# Altium schematic sheet Voltage_Regulation.SchDoc
size A4
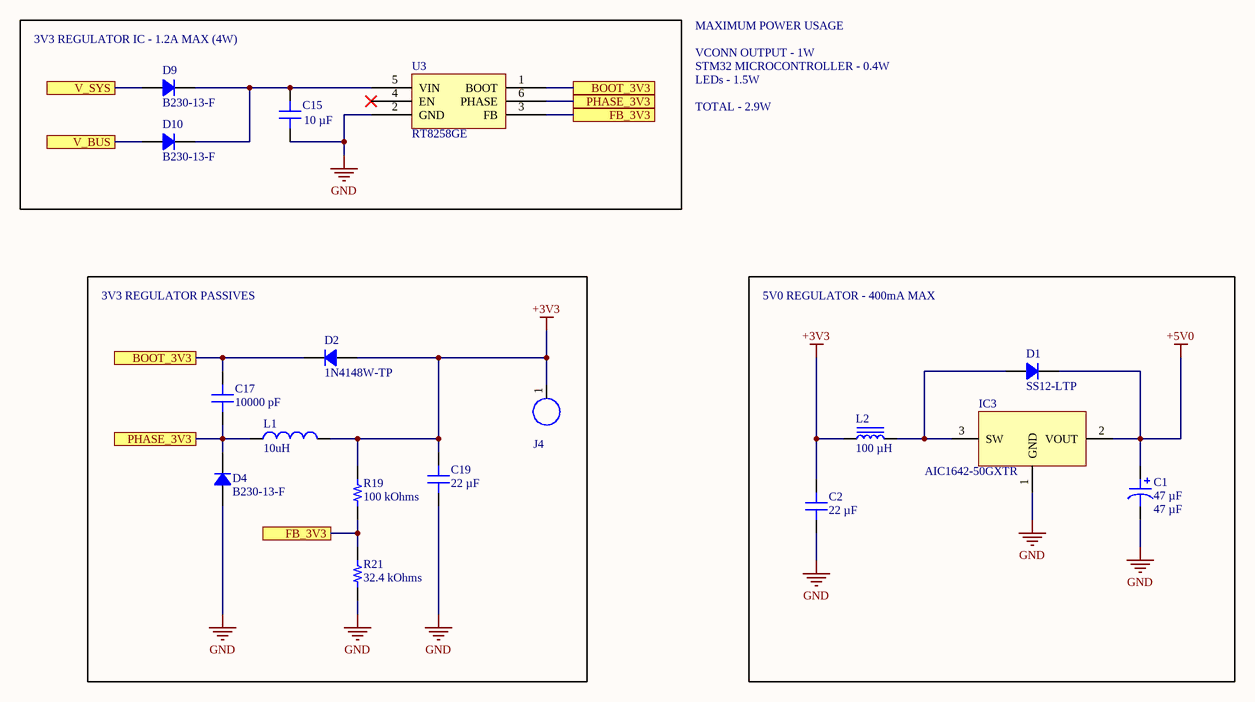
[diagram p0: Voltage_Regulation.SchDoc]

## Parts
C1  47 µF  [CAP POL 1411_3528]
C2  22 µF  [CAP 1206_3216 - 0.8MM]
C15  10 µF  [CAP 1206_3216 - 0.8MM]
C17  10000 pF  [CAP 0402_1005]
C19  22 µF  [CAP 1206_3216 - 0.8MM]
D1  SS12-LTP  [DO214AC SMA]
D2  1N4148W-TP  [SOD-123]
D4  B230-13-F  [DO214AA SMB]
D9  B230-13-F  [DO214AA SMB]
D10  B230-13-F  [DO214AA SMB]
IC3  AIC1642-50GXTR  [SOT89-150P410X160-3N]
J4  Large Board Solder Point  [Large Solder Point]  (value not drawn)  (no BOM)
L1  10uH  [0630CDMCCDS-100MC]
L2  100 µH  [LAIRD TYS5040]
R19  100 kOhms  [RES 0402_1005]
R21  32.4 kOhms  [RES 0402_1005]
U3  RT8258GE  [SOT100P279X130-6N]

## Blocks framed on the sheet
3V3 REGULATOR IC - 1.2A MAX (4W): C15 D9 D10 U3
3V3 REGULATOR PASSIVES: C17 C19 D2 D4 J4 L1 R19 R21
5V0 REGULATOR - 400mA MAX: C1 C2 D1 IC3 L2

## Ports
BOOT_3V3, FB_3V3, PHASE_3V3, V_BUS, V_SYS

## Nets
+3V3: C2.1 C19.1 D2.1 J4.1 L1.2 L2.1 R19.2
+5V0: C1.1 D1.2 IC3.2(VOUT)
GND: C1.2 C2.2 C15.1 C19.2 D4.1 IC3.1(GND) R21.1 U3.2(GND)
BOOT_3V3: C17.2 D2.2 U3.1(BOOT) ; port BOOT_3V3
FB_3V3: R19.1 R21.2 U3.3(FB) ; port FB_3V3
PHASE_3V3: C17.1 D4.2 L1.1 U3.6(PHASE) ; port PHASE_3V3
V_BUS: D10.1 ; port V_BUS
V_SYS: D9.1 ; port V_SYS
NetC15_2: C15.2 D9.2 D10.2 U3.5(VIN)
NetD1_1: D1.1 IC3.3(SW) L2.2

Not connected (* = marked no-connect by the designer): U3 4(EN)*

## Notes on the sheet
- VCONN OUTPUT - 1W
- STM32 MICROCONTROLLER - 0.4W
- MAXIMUM POWER USAGE
- LEDs - 1.5W
- TOTAL - 2.9W

## Library data of the parts
C1 = T494B476K010AT: CAP TANT 47UF 10% 10V 1411; manufacturer: KEMET; Manufacturer Size Code: B; ESR (Equivalent Series Resistance): 650mOhm @ 100kHz; Lifetime @ Temp.: 2000 Hrs @ 125°C; Type: Molded; Part Number: T494B476K010AT; Value: 47 µF; Capacitance: 47 µF; componentlink1description: Datasheet; componentlink1url: https://api.kemet.com/component-edge/download/datasheet/T494B476K010AT.pdf; componentlink2description: DigiKey Link; componentlink2url: https://www.digikey.com/en/products/detail/kemet/T494B476K010AT/9642205; Device Package: 1411 (3528 Metric); Features: General Purpose; Height - Seated (Max): 0.083" (2.10mm); lastupdated: 16/02/2023 8:42:18 PM; Lifecycle Status: Active; Minimum Order: 1; Mounting Type: Surface Mount; Operating Temperature: -55°C ~ 125°C; Package / Case: 1411 (3528 Metric); packaging: TapeAndReel; partid: 3; Part Status: Active; price: 0.45; series: T494; Size / Dimension: 0.138" L x 0.110" W (3.50mm x 2.80mm); Supplier 1: DigiKey; Supplier Part Number 1: 399-18791-1-ND; Tolerance: ±10%; Voltage - Rated: 10 V
C2 C19 = GCM31CR70J226KE23L: CAP CER 22UF 6.3V X7R 1206; manufacturer: Murata Electronics; Tolerance: ±10%; Part Number: GCM31CR70J226KE23L; Value: 22 µF; Applications: Automotive; Capacitance: 22 µF; componentlink1description: Datasheet; componentlink1url: https://www.murata.com/~/media/webrenewal/support/library/catalog/products/capacitor/mlcc/c03e.ashx?la=en-us; componentlink2description: DigiKey Link; componentlink2url: https://www.digikey.com/en/products/detail/murata-electronics/GCM31CR70J226KE23L/1763914; Device Package: 1206 (3216 Metric); lastupdated: 9/08/2022 12:05:38 PM; Lifecycle Status: Active; Minimum Order: 1; Mounting Type: Surface Mount, MLCC; Operating Temperature: -55°C ~ 125°C; Package / Case: 1206 (3216 Metric); packaging: TapeAndReel; partid: 19505; Part Status: Active; price: 0.19; Ratings: AEC-Q200; series: GCM; Size / Dimension: 0.126" L x 0.063" W (3.20mm x 1.60mm); Supplier 1: DigiKey; Supplier Part Number 1: 490-4843-1-ND; Temperature Coefficient: X7R; Thickness (Max): 0.071" (1.80mm); Voltage - Rated: 6.3V
C15 = GRM31CR71E106MA12K: CAP CER 10UF 25V X7R 1206; manufacturer: Murata Electronics; Tolerance: ±20%; Part Number: GRM31CR71E106MA12K; Value: 10 µF; Applications: General Purpose; Capacitance: 10 µF; componentlink1description: Datasheet; componentlink1url: https://search.murata.co.jp/Ceramy/image/img/A01X/G101/ENG/GRM31CR71E106MA12-01CA.pdf; componentlink2description: DigiKey Link; componentlink2url: https://www.digikey.com/en/products/detail/murata-electronics/GRM31CR71E106MA12K/13904832; Device Package: 1206 (3216 Metric); lastupdated: 9/08/2022 12:05:16 PM; Lifecycle Status: Active; Minimum Order: 1; Mounting Type: Surface Mount, MLCC; Operating Temperature: -55°C ~ 125°C; Package / Case: 1206 (3216 Metric); packaging: TapeAndReel; partid: 30277; Part Status: Active; price: 0.07; series: GRM; Size / Dimension: 0.126" L x 0.063" W (3.20mm x 1.60mm); Supplier 1: DigiKey; Supplier Part Number 1: 490-GRM31CR71E106MA12KCT-ND; Temperature Coefficient: X7R; Thickness (Max): 0.071" (1.80mm); Voltage - Rated: 25V
C17 = VJ0402Y103JXQCW1BC: CAP CER 10000PF 10V X7R 0402; manufacturer: Vishay Vitramon; Tolerance: ±5%; Part Number: VJ0402Y103JXQCW1BC; Value: 10000 pF; Applications: General Purpose; Capacitance: 10000 pF; componentlink1description: Datasheet; componentlink1url: https://www.vishay.com/docs/28548/vjw1bcbascomseries.pdf; componentlink2description: DigiKey Link; componentlink2url: https://www.digikey.com/en/products/detail/vishay-vitramon/VJ0402Y103JXQCW1BC/8301965; Device Package: 0402 (1005 Metric); lastupdated: 9/08/2022 12:01:13 PM; Lifecycle Status: Active; Minimum Order: 1; Mounting Type: Surface Mount, MLCC; Operating Temperature: -55°C ~ 125°C; Package / Case: 0402 (1005 Metric); packaging: TapeAndReel; partid: 4459; Part Status: Active; price: 0.01; series: VJ; Size / Dimension: 0.039" L x 0.020" W (1.00mm x 0.50mm); Supplier 1: DigiKey; Supplier Part Number 1: 720-1645-1-ND; Temperature Coefficient: X7R; Thickness (Max): 0.022" (0.55mm); Voltage - Rated: 10V
D1 = SS12-LTP: DIODE SCHOTTKY 20V 1A DO214AC; Manufacturer: Micro Commercial Co; Capacitance @ Vr, F: 110pF @ 4V, 1MHz; Current - Reverse Leakage @ Vr: 500 µA @ 20 V; Speed: Fast Recovery =< 500ns, > 200mA (Io); Voltage - Forward (Vf) (Max) @ If: 500 mV @ 1 A; Part Number: SS12-LTP; ComponentLink1Description: Datasheet; ComponentLink1URL: https://www.mccsemi.com/pdf/Products/SS12-L-SS110-L(DO-214AC)-E.pdf; ComponentLink2Description: DigiKey Link; ComponentLink2URL: https://www.digikey.com/en/products/detail/micro-commercial-co/SS12-LTP/7681874; Current - Average Rectified (Io): 1A; Diode Type: Schottky; LastUpdated: 19/09/2022 1:46:10 PM; Lifecycle Status: Active; Minimum Order: 1; Mounting Type: Surface Mount; Operating Temperature - Junction: -55°C ~ 150°C; Package / Case: DO-214AC, SMA; Packaging: TapeAndReel; PartId: 2057; Part Status: Active; Price: 0.05; Series: -; Supplier 1: DigiKey; Supplier Part Number 1: SS12-LTPMSCT-ND; Supplier Device Package: DO-214AC (SMA); Voltage - DC Reverse (Vr) (Max): 20 V
D2 = 1N4148W-TP: DIODE GEN PURP 100V 150MA SOD123; Manufacturer: Micro Commercial Co; Capacitance @ Vr, F: 2pF @ 0V, 1MHz; Current - Reverse Leakage @ Vr: 1 µA @ 75 V; Diode Type: Standard; Reverse Recovery Time (trr): 4 ns; Speed: Small Signal =< 200mA (Io), Any Speed; Voltage - Forward (Vf) (Max) @ If: 1.25 V @ 150 mA; Part Number: 1N4148W-TP; ComponentLink1Description: Datasheet; ComponentLink1URL: https://www.mccsemi.com/pdf/Products/1N4148W(SOD123).pdf; ComponentLink2Description: DigiKey Link; ComponentLink2URL: https://www.digikey.com/en/products/detail/micro-commercial-co/1N4148W-TP/717196; Current - Average Rectified (Io): 150mA; LastUpdated: 9/08/2022 12:37:52 PM; Lifecycle Status: Active; Minimum Order: 1; Mounting Type: Surface Mount; Operating Temperature - Junction: -65°C ~ 150°C; Package / Case: SOD-123; Packaging: TapeAndReel; PartId: 999; Part Status: Active; Price: 0.02; Series: -; Supplier 1: DigiKey; Supplier Part Number 1: 1N4148WTPMSCT-ND; Supplier Device Package: SOD-123; Voltage - DC Reverse (Vr) (Max): 100 V
D4 D9 D10 = B230-13-F: DIODE SCHOTTKY 30V 2A SMB; Manufacturer: Diodes Incorporated; Capacitance @ Vr, F: 200pF @ 4V, 1MHz; Current - Reverse Leakage @ Vr: 500 µA @ 30 V; Speed: Fast Recovery =< 500ns, > 200mA (Io); Voltage - Forward (Vf) (Max) @ If: 500 mV @ 2 A; Part Number: B230-13-F; ComponentLink1Description: Datasheet; ComponentLink1URL: https://www.diodes.com/assets/Datasheets/ds13004.pdf; ComponentLink2Description: DigiKey Link; ComponentLink2URL: https://www.digikey.com/en/products/detail/diodes-incorporated/B230-13-F/814955; Current - Average Rectified (Io): 2A; Diode Type: Schottky; LastUpdated: 9/08/2022 12:37:20 PM; Lifecycle Status: Active; Minimum Order: 1; Mounting Type: Surface Mount; Operating Temperature - Junction: -65°C ~ 150°C; Package / Case: DO-214AA, SMB; Packaging: TapeAndReel; PartId: 1539; Part Status: Active; Price: 0.13; Series: -; Supplier 1: DigiKey; Supplier Part Number 1: B230-FDICT-ND; Supplier Device Package: SMB; Voltage - DC Reverse (Vr) (Max): 30 V
IC3 = AIC1642-50GXTR: C238214 NO Boost type 1 Boost 5V 0.9V~1.5V 400mA 100kHz SOT-89(SOT-89-3) DC-DC Converters ROHS
L1 = 0630CDMCCDS-100MC: 4A 10uH ±20% 67mΩ SMD,7x6.6x2.8mm Power Inductors ROHS
L2 = TYS5040101M-10: FIXED IND 100UH 700MA 560MOHM SM; Manufacturer: Laird-Signal Integrity Products; Current - Saturation: 750mA; DC Resistance (DCR): 560mOhm Max; Frequency - Self Resonant: 4.7MHz; Inductance Frequency - Test: 100 kHz; Material - Core: Nonstandard; Shielding: Shielded; Tolerance: ±20%; Part Number: TYS5040101M-10; ComponentLink1Description: Datasheet; ComponentLink1URL: https://assets.lairdtech.com/home/brandworld/files/Catalog_FERRITE%20CORES%200717.pdf; ComponentLink2Description: DigiKey Link; ComponentLink2URL: https://www.digikey.com/en/products/detail/laird-signal-integrity-products/TYS5040101M-10/4733468; Current Rating (Amps): 700 mA; Device Package: Nonstandard; Height - Seated (Max): 0.165" (4.20mm); Inductance: 100 µH; LastUpdated: 19/09/2022 2:06:59 PM; Lifecycle Status: Active; Minimum Order: 1; Mounting Type: Surface Mount; Operating Temperature: -40°C ~ 125°C; Package / Case: Nonstandard; Packaging: TapeAndReel; PartId: 3554; Part Status: Active; Price: 0.18; Series: TYS5040; Size / Dimension: 0.197" L x 0.197" W (5.00mm x 5.00mm); Supplier 1: DigiKey; Supplier Part Number 1: 240-2711-1-ND; Value: 100 µH
R19 = RP73PF1E100KBTD: RES 100K OHM 0.1% 1/10W 0402; Manufacturer: TE Connectivity Passive Product; Power (Watts): 0.1W, 1/10W; Temperature Coefficient: ±25ppm/°C; Part Number: RP73PF1E100KBTD; Value: 100 kOhms; ComponentLink1Description: Datasheet; ComponentLink1URL: https://www.te.com/commerce/DocumentDelivery/DDEController?Action=srchrtrv&DocNm=1773272&DocType=DS&DocLang=English; ComponentLink2Description: DigiKey Link; ComponentLink2URL: https://www.digikey.com/en/products/detail/te-connectivity-passive-product/RP73PF1E100KBTD/8261053; Composition: Thin Film; Device Package: 0402 (1005 Metric); Height - Seated (Max): 0.014" (0.35mm); LastUpdated: 9/08/2022 12:11:04 PM; Lifecycle Status: Active; Minimum Order: 1; Number of Terminations: 2; Operating Temperature: -55°C ~ 155°C; Package / Case: 0402 (1005 Metric); Packaging: TapeAndReel; PartId: 2436; Part Status: Active; Price: 0.09; Resistance: 100 kOhms; Series: RP73, Holsworthy; Size / Dimension: 0.039" L x 0.020" W (1.00mm x 0.50mm); Supplier 1: DigiKey; Supplier Part Number 1: A127511CT-ND; Supplier Device Package: 0402; Tolerance: ±0.1%
R21 = CPF0402B32K4E1: RES SMD 32.4KOHM 0.1% 1/16W 0402; Manufacturer: TE Connectivity Passive Product; Power (Watts): 0.063W, 1/16W; Temperature Coefficient: ±25ppm/°C; Part Number: CPF0402B32K4E1; Value: 32.4 kOhms; ComponentLink1Description: Datasheet; ComponentLink1URL: https://www.te.com/commerce/DocumentDelivery/DDEController?Action=srchrtrv&DocNm=1773200&DocType=DS&DocLang=English; ComponentLink2Description: DigiKey Link; ComponentLink2URL: https://www.digikey.com/en/products/detail/te-connectivity-passive-product/CPF0402B32K4E1/2382531; Composition: Thin Film; Device Package: 0402 (1005 Metric); Height - Seated (Max): 0.014" (0.35mm); LastUpdated: 9/08/2022 12:10:59 PM; Lifecycle Status: Active; Minimum Order: 1; Number of Terminations: 2; Operating Temperature: -55°C ~ 155°C; Package / Case: 0402 (1005 Metric); Packaging: TapeAndReel; PartId: 4116; Part Status: Active; Price: 0.15; Resistance: 32.4 kOhms; Series: CPF, Neohm; Size / Dimension: 0.039" L x 0.020" W (1.00mm x 0.50mm); Supplier 1: DigiKey; Supplier Part Number 1: A102795CT-ND; Supplier Device Package: 0402; Tolerance: ±0.1%
U3 = RT8258GE: RICHTEK 1.2A, 24V, 700kHz Step-Down Converter SOT23-6